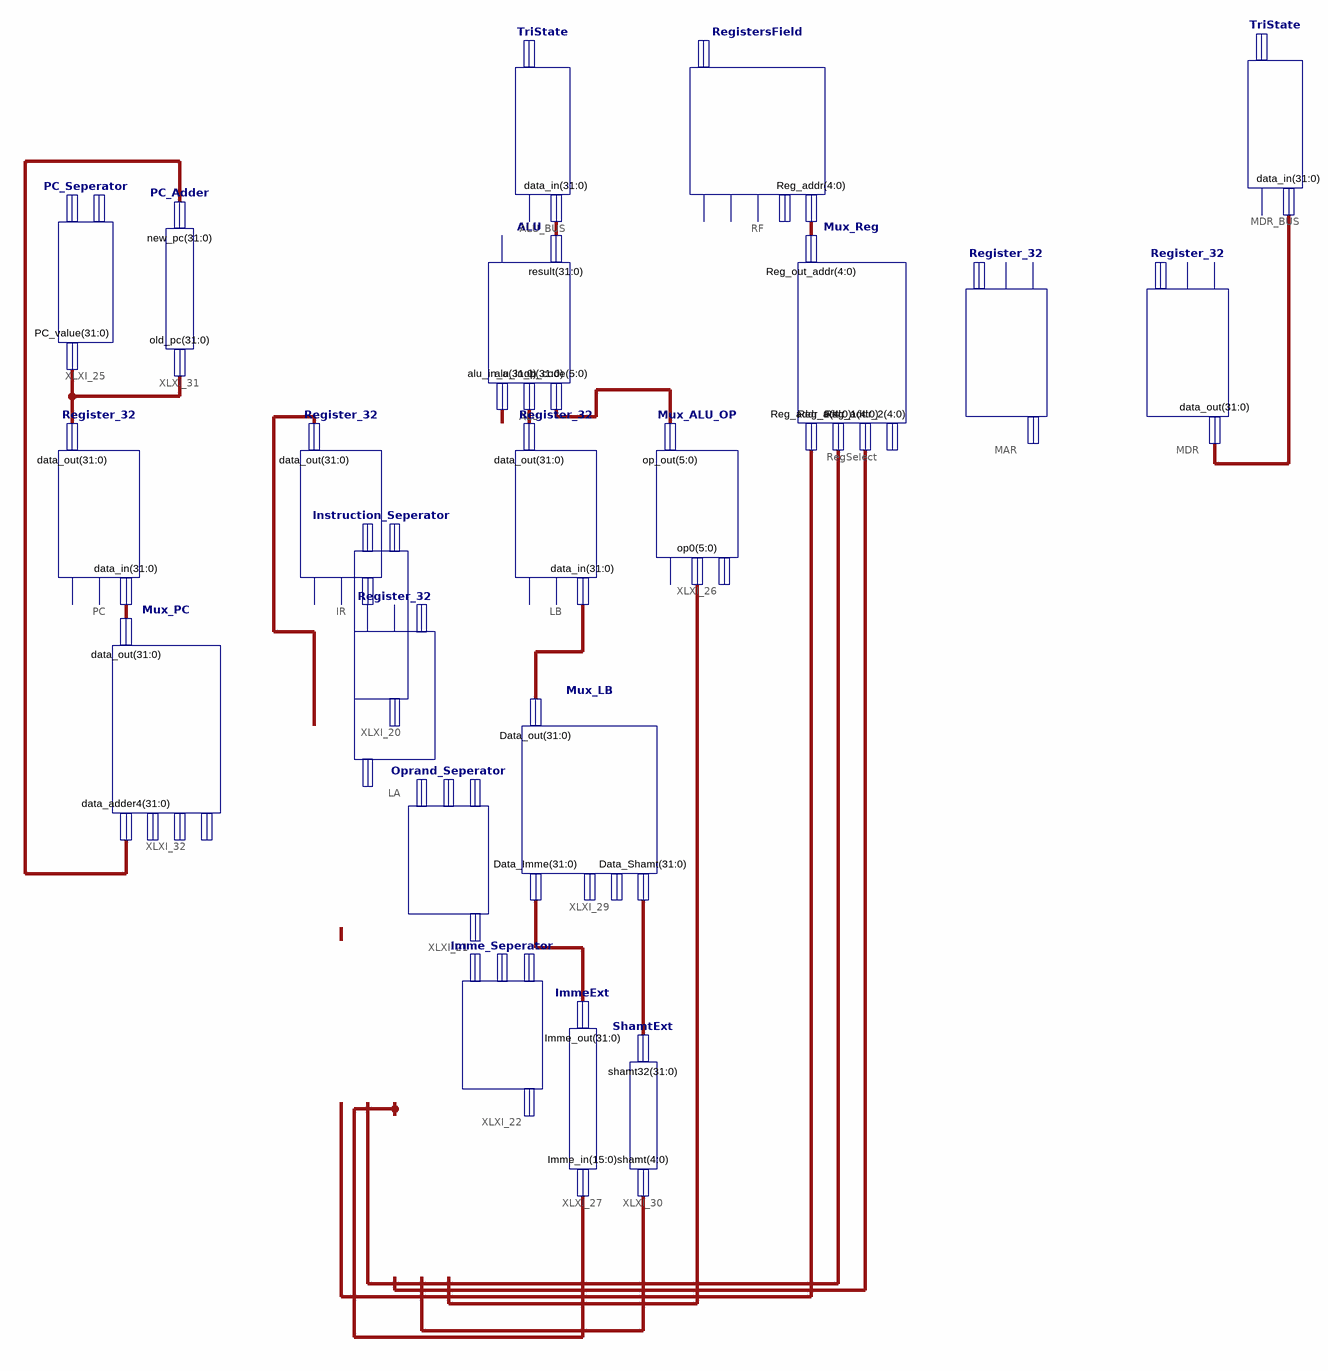
[diagram p0: schematic sheet 1]
// Xilinx ISE schematic MyCPU1.sch (xc9500) as structural Verilog: 21 symbols, 0 ports
module MyCPU1 (
);

  wire [4:0] XLXN_11, XLXN_29, XLXN_30, XLXN_31, XLXN_43;
  wire [5:0] XLXN_35, XLXN_36;
  wire [15:0] XLXN_38;
  wire [25:0] XLXN_25;
  wire [31:0] XLXN_6, XLXN_14, XLXN_16, XLXN_20, XLXN_21, XLXN_41, XLXN_42, XLXN_44, XLXN_46, XLXN_47,
       XLXN_48;

  ALU ALU (.alu_in_a(XLXN_16), .alu_in_b(XLXN_14), .op_code(XLXN_36), .result(XLXN_6));  // open: flag_z
  RegistersField RF (.Reg_addr(XLXN_11));  // open: WE, OE, clk, W_data, R_data
  TriState ALU_BUS (.data_in(XLXN_6));  // open: ctrl, data_out
  Mux_Reg RegSelect (
    .Reg_addr_0(XLXN_29), .Reg_addr_1(XLXN_30), .Reg_addr_2(XLXN_31), .Reg_out_addr(XLXN_11));  // open: Reg_Key
  Register_32 LA (.data_out(XLXN_16));  // open: WE, clk, data_in
  Register_32 LB (.data_in(XLXN_42), .data_out(XLXN_14));  // open: WE, clk
  Register_32 IR (.data_out(XLXN_21));  // open: WE, clk, data_in
  Register_32 PC (.data_in(XLXN_47), .data_out(XLXN_46));  // open: WE, clk
  Register_32 MAR ();  // open: WE, clk, data_in, data_out
  Register_32 MDR (.data_out(XLXN_20));  // open: WE, clk, data_in
  TriState MDR_BUS (.data_in(XLXN_20));  // open: ctrl, data_out
  Instruction_Seperator XLXI_20 (.instruction_in(XLXN_21), .OPrand(XLXN_25));  // open: OPcode
  Oprand_Seperator XLXI_21 (.oprand(XLXN_25), .Rs(XLXN_29), .Rt(XLXN_30), .Imme(XLXN_38));
  Imme_Seperator XLXI_22 (.Imme(XLXN_38), .Rd(XLXN_31), .shamt(XLXN_43), .alu_func(XLXN_35));
  PC_Seperator XLXI_25 (.PC_value(XLXN_46));  // open: high4, low4
  Mux_ALU_OP XLXI_26 (.op0(XLXN_35), .op_out(XLXN_36));  // open: op_select, op1
  ImmeExt XLXI_27 (.Imme_in(XLXN_38), .Imme_out(XLXN_41));
  Mux_LB XLXI_29 (.Data_Imme(XLXN_41), .Data_out(XLXN_42), .Data_Shamt(XLXN_44));  // open: Data_Bus, Data_select
  ShamtExt XLXI_30 (.shamt(XLXN_43), .shamt32(XLXN_44));
  PC_Adder XLXI_31 (.old_pc(XLXN_46), .new_pc(XLXN_48));
  Mux_PC XLXI_32 (.data_adder4(XLXN_48), .data_out(XLXN_47));  // open: data_bus, data_addr_merge, data_select
endmodule
